# Altium project bms_mainboard-1_1.PrjPcb (part 5 of 8)

## Sheet st-link-v2.SchDoc
size C
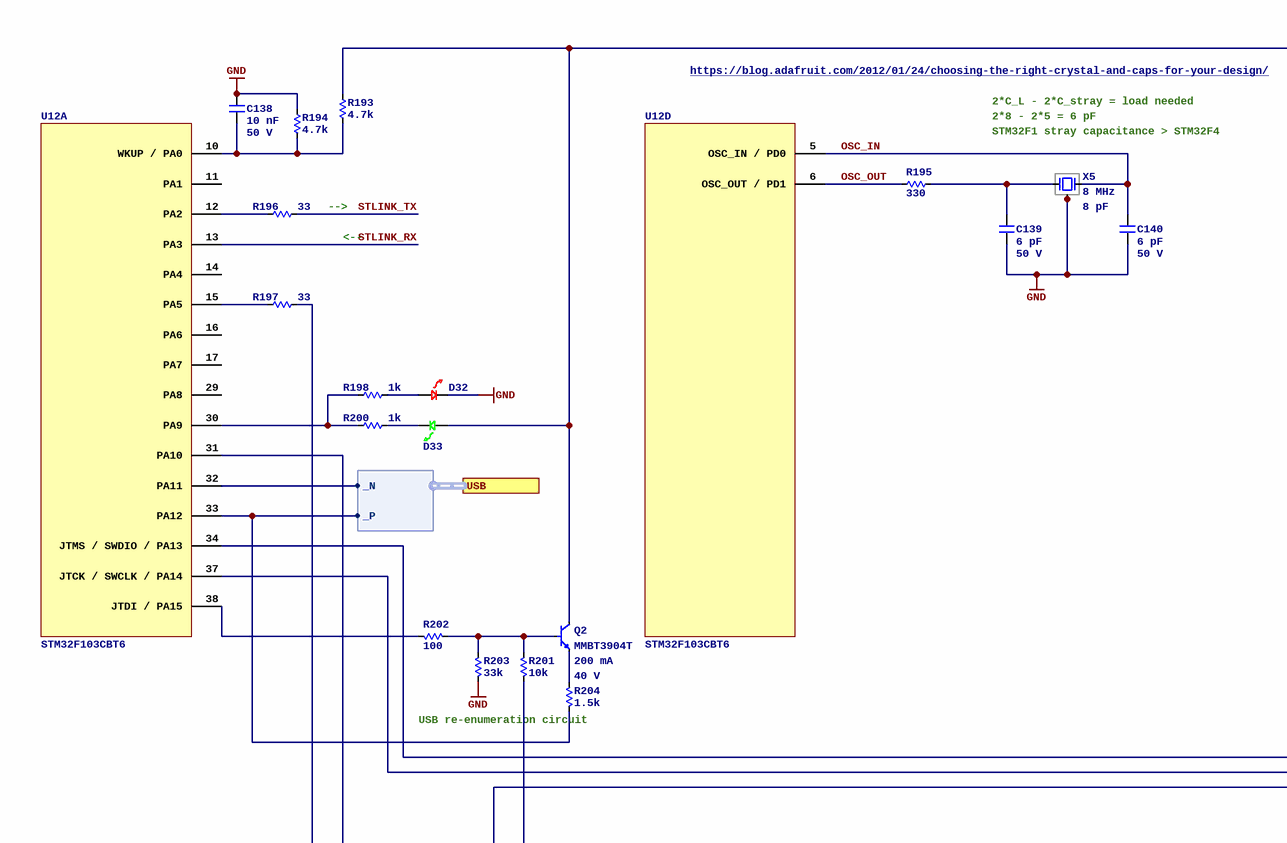
[diagram p25: st-link-v2.SchDoc, top left]
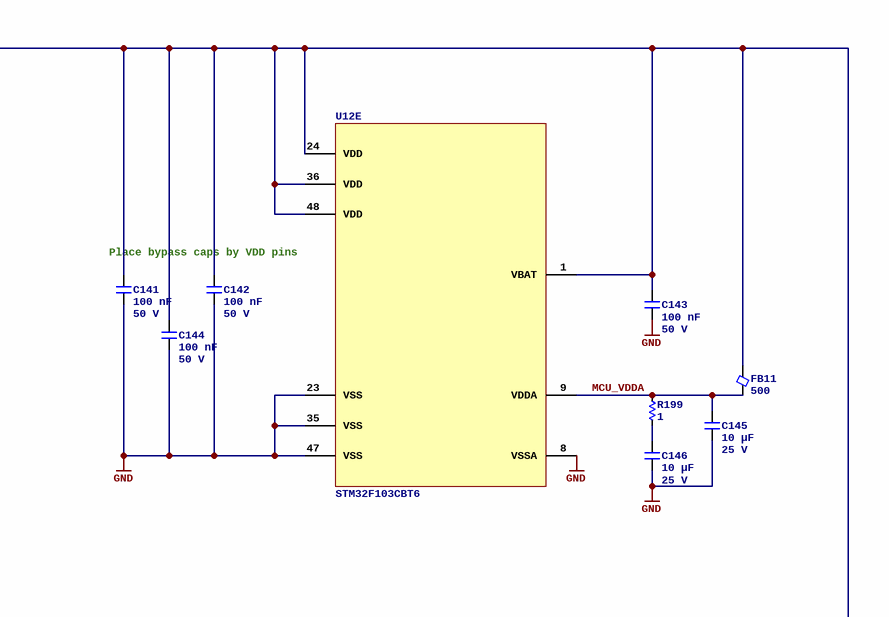
[diagram p26: st-link-v2.SchDoc, top right]
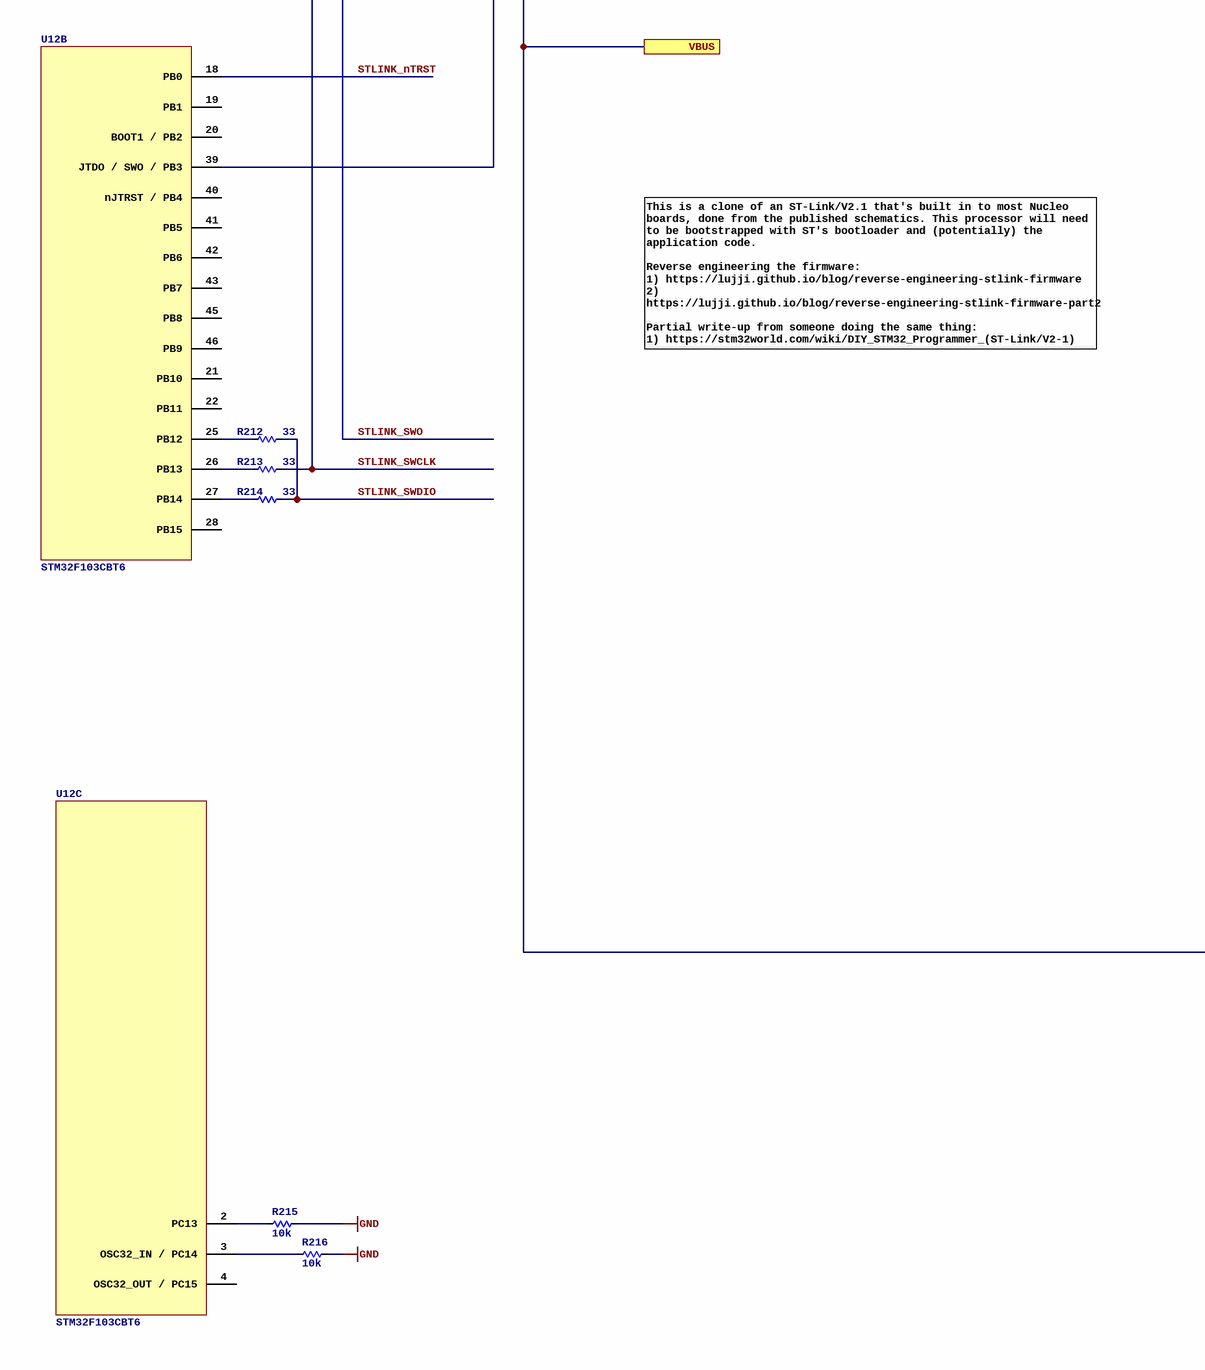
[diagram p27: st-link-v2.SchDoc, bottom left]
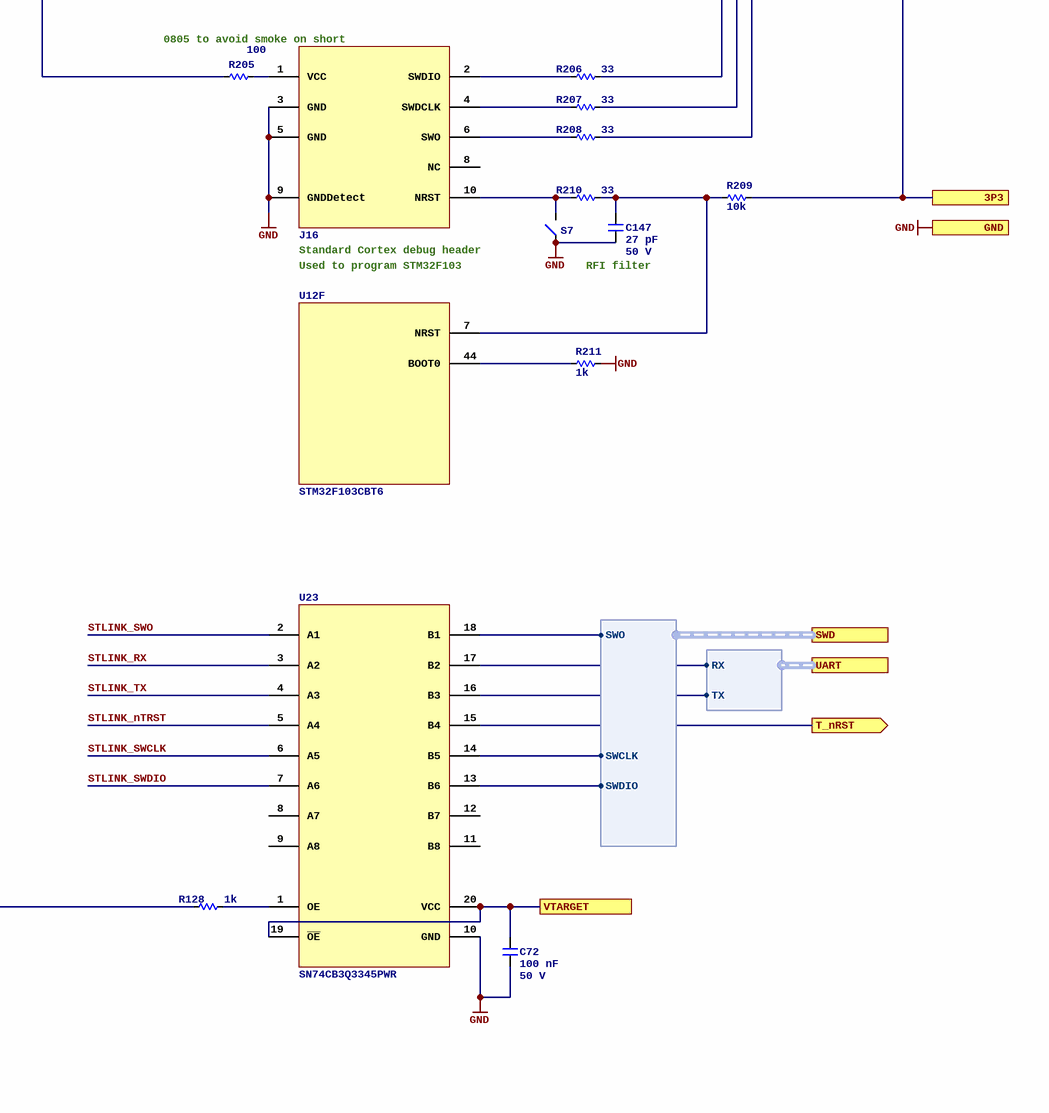
[diagram p28: st-link-v2.SchDoc, bottom right]

### Parts
C72  Capacitance: 100 nF  Voltage Rating: 50 V  [C0402]  (hidden comment: CL05B104KB54PNC)
C138  Capacitance: 10 nF  Voltage Rating: 50 V  [C0402]  (hidden comment: CL05B103KB5NNNC)
C139  Capacitance: 6 pF  Voltage Rating: 50 V  [C0402]  (hidden comment: 0402CG6R0C500NT)
C140  Capacitance: 6 pF  Voltage Rating: 50 V  [C0402]  (hidden comment: 0402CG6R0C500NT)
C141  Capacitance: 100 nF  Voltage Rating: 50 V  [C0402]  (hidden comment: CL05B104KB54PNC)
C142  Capacitance: 100 nF  Voltage Rating: 50 V  [C0402]  (hidden comment: CL05B104KB54PNC)
C143  Capacitance: 100 nF  Voltage Rating: 50 V  [C0402]  (hidden comment: CL05B104KB54PNC)
C144  Capacitance: 100 nF  Voltage Rating: 50 V  [C0402]  (hidden comment: CL05B104KB54PNC)
C145  Capacitance: 10 µF  Voltage Rating: 25 V  [C0603]  (hidden comment: CL10A106MA8NRNC)
C146  Capacitance: 10 µF  Voltage Rating: 25 V  [C0805]  (hidden comment: CL21B106KAYQNNE)
C147  Capacitance: 27 pF  Voltage Rating: 50 V  [C0402]  (hidden comment: 0402CG270J500NT)
D32  LTST-C190KRKT  [LED_0603P_RED]  (value not drawn)
D33  LTST-C190GKT  [LED_0603P_GREEN]  (value not drawn)
FB11  Current Rating (mA): 500  [FB0402]  (hidden comment: BLM15AX601SN1D)
J16  FTSH-105-01-L-DV-K  [FTSH-105-01-L-DV-K_KEYED]  (value not drawn)
Q2  MMBT3904T  Current: 200 mA  Voltage: 40 V  [3SOT523]
R128  value 1k  [R0402]  (hidden comment: 0402WGF1001TCE)
R193  value 4.7k  [R0402]  (hidden comment: 0402WGF4701TCE)
R194  value 4.7k  [R0402]  (hidden comment: 0402WGF4701TCE)
R195  value 330  [R0402]  (hidden comment: 0402WGF3300TCE)
R196  value 33  [R0402]  (hidden comment: 0402WGF330JTCE)
R197  value 33  [R0402]  (hidden comment: 0402WGF330JTCE)
R198  value 1k  [R0402]  (hidden comment: 0402WGF1001TCE)
R199  value 1  [R0402]  (hidden comment: CRCW04021R00FKED)
R200  value 1k  [R0402]  (hidden comment: 0402WGF1001TCE)
R201  value 10k  [R0402]  (hidden comment: 0402WGF1002TCE)
R202  value 100  [R0402]  (hidden comment: RC0402FR-07100RL)
R203  value 33k  [R0402]  (hidden comment: 0402WGF3302TCE)
R204  value 1.5k  [R0402]  (hidden comment: 0402WGF1501TCE)
R205  value 100  [R0805]  (hidden comment: ERJP06F1000V)
R206  value 33  [R0402]  (hidden comment: 0402WGF330JTCE)
R207  value 33  [R0402]  (hidden comment: 0402WGF330JTCE)
R208  value 33  [R0402]  (hidden comment: 0402WGF330JTCE)
R209  value 10k  [R0402]  (hidden comment: 0402WGF1002TCE)
R210  value 33  [R0402]  (hidden comment: 0402WGF330JTCE)
R211  value 1k  [R0402]  (hidden comment: 0402WGF1001TCE)
R212  value 33  [R0402]  (hidden comment: 0402WGF330JTCE)
R213  value 33  [R0402]  (hidden comment: 0402WGF330JTCE)
R214  value 33  [R0402]  (hidden comment: 0402WGF330JTCE)
R215  value 10k  [R0402]  (hidden comment: 0402WGF1002TCE)
R216  value 10k  [R0402]  (hidden comment: 0402WGF1002TCE)
S7  TS-1092S-B3D2-G  [SWITCH_TS-1092S-B3D2-G]  (value not drawn)
U12  STM32F103CBT6  [48TQFP7]  (parts A,B,C,D,E,F of 6)
U23  SN74CB3Q3345PWR  [TI_PW0020A]
X5  Frequency: 8 MHz  Capacitance: 8 pF  [4_SMD_3.2X2.5MM]  (hidden comment: ECS-80-8-33Q-JES-TR)

### Ports
3P3, GND, SWD (harness SWD), T_nRST (out), UART (harness UART), USB (harness DIFF), VBUS, VTARGET

### Harnesses
DIFF: _P, _N
SWD: SWO, SWCLK, SWDIO
UART: RX, TX

### Nets
3P3: C72.1 U23.19(~{OE}) U23.20(VCC) ; port VTARGET
3P3_USB: C141.1 C142.1 C143.1 C144.1 D33.1 FB11.2 Q2.3(C) R193.2 R205.2 R209.1 U12.1(VBAT) U12.24(VDD) U12.36(VDD) U12.48(VDD) ; port 3P3
GND: C72.2 C138.1 C139.2 C140.2 C141.2 C142.2 C143.2 C144.2 C145.2 C146.2 C147.2 D32.2 J16.3(GND) J16.5(GND) J16.9(GNDDetect) R194.2 R203.2 R211.2 R215.2 R216.2 S7.1 U12.8(VSSA) U12.23(VSS) U12.35(VSS) U12.47(VSS) U23.10(GND) X5.2 X5.4 ; port GND
VBUS: R128.2 R201.1 ; port VBUS
MCU_nRST: U23.15(B4) ; port T_nRST
MCU_VDDA: C145.1 FB11.1 R199.2 U12.9(VDDA)
OSC_IN: C140.1 U12.5(OSC_IN_/_PD0) X5.3
OSC_OUT: R195.1 U12.6(OSC_OUT_/_PD1)
STLINK_nTRST: U12.18(PB0) U23.5(A4)
STLINK_RX: U12.13(PA3) U23.3(A2)
STLINK_SWCLK: R197.1 R213.1 U23.6(A5)
STLINK_SWDIO: R212.1 R214.1 U23.7(A6)
STLINK_SWO: U12.31(PA10) U23.2(A1)
STLINK_TX: R196.1 U23.4(A3)
SWD.SWCLK: U23.14(B5) ; port SWD.SWCLK
SWD.SWDIO: U23.13(B6) ; port SWD.SWDIO
SWD.SWO: U23.18(B1) ; port SWD.SWO
UART7.RX: U23.16(B3) ; port UART.TX
UART7.TX: U23.17(B2) ; port UART.RX
USB_DFP2._N: U12.32(PA11) ; port USB._N
USB_DFP2._P: R204.2 U12.33(PA12) ; port USB._P
NetC138_2: C138.2 R193.1 R194.1 U12.10(WKUP_/_PA0)
NetC139_1: C139.1 R195.2 X5.1
NetC146_1: C146.1 R199.1
NetC147_1: C147.1 R209.2 R210.1 U12.7(NRST)
NetD32_1: D32.1 R198.1
NetD33_2: D33.2 R200.1
NetJ16_1: J16.1(VCC) R205.1
NetJ16_2: J16.2(SWDIO) R206.2
NetJ16_4: J16.4(SWDCLK) R207.2
NetJ16_6: J16.6(SWO) R208.2
NetJ16_10: J16.10(NRST) R210.2 S7.2
NetQ2_1: Q2.1(B) R201.2 R202.1 R203.1
NetQ2_2: Q2.2(E) R204.1
NetR128_1: R128.1 U23.1(OE)
NetR196_2: R196.2 U12.12(PA2)
NetR197_2: R197.2 U12.15(PA5)
NetR198_2: R198.2 R200.2 U12.30(PA9)
NetR202_2: R202.2 U12.38(JTDI_/_PA15)
NetR206_1: R206.1 U12.34(JTMS_/_SWDIO_/_PA13)
NetR207_1: R207.1 U12.37(JTCK_/_SWCLK_/_PA14)
NetR208_1: R208.1 U12.39(JTDO_/_SWO_/_PB3)
NetR211_1: R211.1 U12.44(BOOT0)
NetR212_2: R212.2 U12.25(PB12)
NetR213_2: R213.2 U12.26(PB13)
NetR214_2: R214.2 U12.27(PB14)
NetR215_1: R215.1 U12.2(PC13)
NetR216_1: R216.1 U12.3(OSC32_IN_/_PC14)

Not connected (* = marked no-connect by the designer): J16 8(NC); U12 4(OSC32_OUT_/_PC15) 11(PA1) 14(PA4) 16(PA6) 17(PA7) 19(PB1) 20(BOOT1_/_PB2) 21(PB10) 22(PB11) 28(PB15) 29(PA8) 40(nJTRST_/_PB4) 41(PB5) 42(PB6) 43(PB7) 45(PB8) 46(PB9); U23 8(A7) 9(A8) 11(B8) 12(B7)

### Notes on the sheet
- https://blog.adafruit.com/2012/01/24/choosing-the-right-crystal-and-caps-for-your-design/
- 2*C_L - 2*C_stray = load needed
- 2*8 - 2*5 = 6 pF
- (near X5) STM32F1 stray capacitance > STM32F4
- (near R196) -->
- (near R196) <--
- Place bypass caps by VDD pins
- (near R204) USB re-enumeration circuit
- 0805 to avoid smoke on short
- Standard Cortex debug header
- This is a clone of an ST-Link/V2.1 that's built in to most Nucleo boards, done from the published schematics. This processor will need to be bootstrapped with ST's bootloader and (potentially) the application code.
  Reverse engineering the firmware:
  1) https://lujji.github.io/blog/reverse-engineering-stlink-firmware
  2) https://lujji.github.io/blog/reverse-engineering-stlink-firmware-part2
  Partial write-up from someone doing the same thing:
  1) https://stm32world.com/wiki/DIY_STM32_Programmer_(ST-Link/V2-1)
- Used to program STM32F103
- RFI filter

### Library data of the parts
C72 C141-C144 = CL05B104KB54PNC: Manufacturer: Samsung Electro-Mechanics; Dielectric: X7R; ComponentLink1URL: https://wmsc.lcsc.com/wmsc/upload/file/pdf/v2/lcsc/2304140030_Samsung-Electro-Mechanics-CL05B104KB54PNC_C307331.pdf; ComponentLink1Description: Datasheet; Manufacturer Part Number: CL05B104KB54PNC; Package: 0402; Supplier 2: LCSC; Supplier Part Number 2: C307331
C138 = CL05B103KB5NNNC: Manufacturer: Samsung Electro-Mechanics; Dielectric: X7R; ComponentLink1URL: https://wmsc.lcsc.com/wmsc/upload/file/pdf/v2/lcsc/2304140030_Samsung-Electro-Mechanics-CL05B103KB5NNNC_C15195.pdf; ComponentLink1Description: Datasheet; Manufacturer Part Number: CL05B103KB5NNNC; Package: 0402; Supplier 2: LCSC; Supplier Part Number 2: C15195
C139 C140 = 0402CG6R0C500NT: Manufacturer: FH(Guangdong Fenghua Advanced Tech); Dielectric: C0G; ComponentLink1URL: https://wmsc.lcsc.com/wmsc/upload/file/pdf/v2/lcsc/2304140030_FH--Guangdong-Fenghua-Advanced-Tech-0402CG6R0C500NT_C1575.pdf; ComponentLink1Description: Datasheet; Manufacturer Part Number: 0402CG6R0C500NT; Package: 0402; Supplier 2: LCSC; Supplier Part Number 2: C1575
C145 = CL10A106MA8NRNC: Manufacturer: Samsung Electro-Mechanics; Dielectric: X5R; ComponentLink1URL: https://wmsc.lcsc.com/wmsc/upload/file/pdf/v2/lcsc/2304140030_Samsung-Electro-Mechanics-CL10A106MA8NRNC_C96446.pdf; ComponentLink1Description: Datasheet; Manufacturer Part Number: CL10A106MA8NRNC; Package: 0603; Supplier 2: LCSC; Supplier Part Number 2: C96446
C146 = CL21B106KAYQNNE: Manufacturer: Samsung Electro-Mechanics; Dielectric: X7R; ComponentLink1URL: https://datasheet.lcsc.com/lcsc/2206222030_Samsung-Electro-Mechanics-CL21B106KAYQNNE_C3039694.pdf; ComponentLink1Description: Datasheet; Manufacturer Part Number: CL21B106KAYQNNE; Package: 0805; Supplier 2: LCSC; Supplier Part Number 2: C3039694
C147 = 0402CG270J500NT: Manufacturer: FH(Guangdong Fenghua Advanced Tech); Dielectric: C0G; ComponentLink1URL: https://wmsc.lcsc.com/wmsc/upload/file/pdf/v2/lcsc/2304140030_FH--Guangdong-Fenghua-Advanced-Tech-0402CG270J500NT_C1557.pdf; ComponentLink1Description: Datasheet; Manufacturer Part Number: 0402CG270J500NT; Package: 0402; Supplier 2: LCSC; Supplier Part Number 2: C1557
D32 = LTST-C190KRKT: LED SUPER RED CLEAR 0603 SMD; Manufacturer: Lite-On Inc; Vf: 2.0 V; If: 20 mA; ComponentLink1URL: https://optoelectronics.liteon.com/upload/download/DS-22-99-0151/LTST-C190KRKT.pdf; ComponentLink1Description: Datasheet; Supplier 1: DigiKey; Supplier Part Number 1: 160-1436-1-ND; Manufacturer Part Number: LTST-C190KRKT; Supplier 2: LCSC; Supplier Part Number 2: C94869; LED Color: Red; Supplier 3: Mouser; Supplier Part Number 3: 859-LTST-C190KRKT
D33 = LTST-C190GKT: LED GREEN CLEAR 0603 SMD; Manufacturer: Lite-On Inc; Vf: 2.0 V; If: 20 mA; Supplier 1: DigiKey; ComponentLink1URL: https://mm.digikey.com/Volume0/opasdata/d220001/medias/docus/858/LTST-C190GKT.pdf; ComponentLink1Description: Datasheet; Supplier Part Number 1: 160-1183-1-ND; Manufacturer Part Number: LTST-C190GKT; Supplier 2: LCSC; Supplier Part Number 2: C125093; LED Color: Green; Supplier 3: Mouser; Supplier Part Number 3: 859-LTST-C190GKT
FB11 = BLM15AX601SN1D: Manufacturer: Murata Electronics; Z @ 100 MHz: 600; DCR (mOhms): 340; ComponentLink1URL: https://wmsc.lcsc.com/wmsc/upload/file/pdf/v2/lcsc/2304140030_Murata-Electronics-BLM15AX601SN1D_C76886.pdf; ComponentLink1Description: Datasheet; Manufacturer Part Number: BLM15AX601SN1D; Supplier 2: LCSC; Supplier Part Number 2: C76886; Package: 0402
J16 = FTSH-105-01-L-DV-K: CONN HEADER 10 POS DUAL .05" SMD; Manufacturer: Samtec Inc; Supplier 1: DigiKey; ComponentLink1URL: http://www.samtec.com/documents/webfiles/cpdf/FTSH-1XX-XX-XXX-DV-XXX-MKT.pdf; ComponentLink1Description: Datasheet; Supplier Part Number 1: FTSH-105-01-L-DV-K-ND; Manufacturer Part Number: FTSH-105-01-L-DV-K; Supplier 2: LCSC; Supplier Part Number 2: C448647; Supplier 3: Mouser; Supplier Part Number 3: 200-FTSH10501LDVK
Q2 = MMBT3904T: Bipolar (BJT) Transistor NPN 40 V 200 mA 300MHz 150 mW Surface Mount SOT-523; Manufacturer: Shenzhen Slkormicro Semicon Co., Ltd.; Supplier 1: DigiKey; Supplier Part Number 1: 5399-MMBT3904TCT-ND; Manufacturer Part Number: MMBT3904T; ComponentLink1Description: Datasheet; ComponentLink1URL: https://mm.digikey.com/Volume0/opasdata/d220001/medias/docus/7136/5399_MMBT3904T%20SOT-523.pdf; Supplier 2: LCSC; Supplier Part Number 2: C61616; Polarity: NPN
R128 R198 R200 R211 = 0402WGF1001TCE: Manufacturer: UNI-ROYAL(Uniroyal Elec); Tolerance: 1%; Temperature Coefficient: ±100ppm/?; Power Rating (mW): 62.5; ComponentLink1Description: Datasheet; ComponentLink1URL: https://wmsc.lcsc.com/wmsc/upload/file/pdf/v2/lcsc/2206010216_UNI-ROYAL-Uniroyal-Elec-0402WGF1001TCE_C11702.pdf; Manufacturer Part Number: 0402WGF1001TCE; Package: 0402; Supplier 2: LCSC; Supplier Part Number 2: C11702
R193 R194 = 0402WGF4701TCE: Manufacturer: UNI-ROYAL(Uniroyal Elec); Tolerance: 1%; Temperature Coefficient: ±100ppm/?; Power Rating (mW): 62.5; ComponentLink1Description: Datasheet; ComponentLink1URL: https://wmsc.lcsc.com/wmsc/upload/file/pdf/v2/lcsc/2206010045_UNI-ROYAL-Uniroyal-Elec-0402WGF4701TCE_C25900.pdf; Manufacturer Part Number: 0402WGF4701TCE; Package: 0402; Supplier 2: LCSC; Supplier Part Number 2: C25900
R195 = 0402WGF3300TCE: Manufacturer: UNI-ROYAL(Uniroyal Elec); Tolerance: 1%; Temperature Coefficient: ±100ppm/?; Power Rating (mW): 62.5; ComponentLink1Description: Datasheet; ComponentLink1URL: https://wmsc.lcsc.com/wmsc/upload/file/pdf/v2/lcsc/2205311900_UNI-ROYAL-Uniroyal-Elec-0402WGF3300TCE_C25104.pdf; Manufacturer Part Number: 0402WGF3300TCE; Package: 0402; Supplier 2: LCSC; Supplier Part Number 2: C25104
R196 R197 R206-R208 R210 R212-R214 = 0402WGF330JTCE: Manufacturer: UNI-ROYAL(Uniroyal Elec); Tolerance: 1%; Temperature Coefficient: ±100ppm/?; Power Rating (mW): 62.5; ComponentLink1Description: Datasheet; ComponentLink1URL: https://wmsc.lcsc.com/wmsc/upload/file/pdf/v2/lcsc/2205311900_UNI-ROYAL-Uniroyal-Elec-0402WGF330JTCE_C25105.pdf; Manufacturer Part Number: 0402WGF330JTCE; Package: 0402; Supplier 2: LCSC; Supplier Part Number 2: C25105
R199 = CRCW04021R00FKED: Manufacturer: Vishay Intertech; Tolerance: 1%; Temperature Coefficient: ±100ppm/?; Power Rating (mW): 63; ComponentLink1Description: Datasheet; ComponentLink1URL: https://wmsc.lcsc.com/wmsc/upload/file/pdf/v2/lcsc/2211030200_Vishay-Intertech-CRCW04021R00FKED_C482087.pdf; Manufacturer Part Number: CRCW04021R00FKED; Package: 0402; Supplier 2: LCSC; Supplier Part Number 2: C482087
R201 R209 R215 R216 = 0402WGF1002TCE: Manufacturer: UNI-ROYAL(Uniroyal Elec); Tolerance: 1%; Temperature Coefficient: ±100ppm/?; Power Rating (mW): 62.5; ComponentLink1Description: Datasheet; ComponentLink1URL: https://wmsc.lcsc.com/wmsc/upload/file/pdf/v2/lcsc/2206010100_UNI-ROYAL-Uniroyal-Elec-0402WGF1002TCE_C25744.pdf; Manufacturer Part Number: 0402WGF1002TCE; Package: 0402; Supplier 2: LCSC; Supplier Part Number 2: C25744
R202 = RC0402FR-07100RL: Manufacturer: YAGEO; Tolerance: 1%; Temperature Coefficient: ±100ppm/?; Power Rating (mW): 62.5; ComponentLink1Description: Datasheet; ComponentLink1URL: https://wmsc.lcsc.com/wmsc/upload/file/pdf/v2/lcsc/2304140030_YAGEO-RC0402FR-07100RL_C106232.pdf; Manufacturer Part Number: RC0402FR-07100RL; Package: 0402; Supplier 2: LCSC; Supplier Part Number 2: C106232
R203 = 0402WGF3302TCE: Manufacturer: UNI-ROYAL(Uniroyal Elec); Tolerance: 1%; Temperature Coefficient: ±100ppm/?; Power Rating (mW): 62.5; ComponentLink1Description: Datasheet; ComponentLink1URL: https://wmsc.lcsc.com/wmsc/upload/file/pdf/v2/lcsc/2206010100_UNI-ROYAL-Uniroyal-Elec-0402WGF3302TCE_C25779.pdf; Manufacturer Part Number: 0402WGF3302TCE; Package: 0402; Supplier 2: LCSC; Supplier Part Number 2: C25779
R204 = 0402WGF1501TCE: Manufacturer: UNI-ROYAL(Uniroyal Elec); Tolerance: 1%; Temperature Coefficient: ±100ppm/?; Power Rating (mW): 62.5; ComponentLink1Description: Datasheet; ComponentLink1URL: https://wmsc.lcsc.com/wmsc/upload/file/pdf/v2/lcsc/2206010045_UNI-ROYAL-Uniroyal-Elec-0402WGF1501TCE_C25867.pdf; Manufacturer Part Number: 0402WGF1501TCE; Package: 0402; Supplier 2: LCSC; Supplier Part Number 2: C25867
R205 = ERJP06F1000V: Manufacturer: PANASONIC; Tolerance: 1%; Temperature Coefficient: ±100ppm/?; Power Rating (mW): 500; ComponentLink1Description: Datasheet; ComponentLink1URL: https://wmsc.lcsc.com/wmsc/upload/file/pdf/v2/lcsc/2404150944_PANASONIC-ERJP06F1000V_C441975.pdf; Manufacturer Part Number: ERJP06F1000V; Package: 0805; Supplier 2: LCSC; Supplier Part Number 2: C441975
S7 = TS-1092S-B3D2-G: SWITCH TACTILE SPST-NO; Manufacturer: Yuandi; Manufacturer Part Number: TS-1092S-B3D2-G; ComponentLink1Description: Datasheet; ComponentLink1URL: https://www.lcsc.com/datasheet/lcsc_datasheet_2005071437_Yuandi-TS-1092S-B3D2-G_C520860.pdf; Supplier 2: LCSC; Supplier Part Number 2: C520860
U12 = STM32F103CBT6: ARM Cortex-M3 STM32 F1 Microcontroller 32-Bit 72MHz 128kB FLASH LQFP48 STM32F103CBT6; Manufacturer: STMicroelectronics; Supplier 1: DigiKey; Supplier Part Number 1: 497-6288-ND; Manufacturer Part Number: STM32F103CBT6; ComponentLink1Description: Datasheet; ComponentLink1URL: https://www.st.com/resource/en/datasheet/stm32f103cb.pdf; ComponentLink2Description: Reference Manual; ComponentLink2URL: https://www.st.com/resource/en/reference_manual/rm0008-stm32f101xx-stm32f102xx-stm32f103xx-stm32f105xx-and-stm32f107xx-advanced-armbased-32bit-mcus-stmicroelectronics.pdf; Supplier 2: LCSC; Supplier Part Number 2: C8304; Supplier 3: Mouser; Supplier Part Number 3: 511-STM32F103CBT6
U23 = SN74CB3Q3345PWR: Low-voltage high-bandwidth bus switch; Manufacturer: Texas Instruments; Manufacturer Part Number: SN74CB3Q3345PWR; Supplier 1: DigiKey; Supplier Part Number 1: 296-19141-1-ND; Supplier 2: LCSC; Supplier Part Number 2: C2674539; ComponentLink1Description: Datasheet; ComponentLink1URL: https://www.ti.com/lit/ds/symlink/sn74cb3q3345.pdf; Supplier 3: Mouser; Supplier Part Number 3: 595-SN74CB3Q3345PWR
X5 = ECS-80-8-33Q-JES-TR: 8 MHz ±20ppm Crystal 8pF 500 Ohms 4-SMD, No Lead; Manufacturer: ECS Inc.; Supplier 1: DigiKey; Supplier Part Number 1: 50-ECS-80-8-33Q-JES-TRCT-ND; Manufacturer Part Number: ECS-80-8-33Q-JES-TR; Supplier 2: LCSC; Supplier Part Number 2: C5727442; ComponentLink1Description: Datasheet; ComponentLink1URL: https://ecsxtal.com/store/pdf/ECX-33Q.pdf; Supplier 3: Mouser; Supplier Part Number 3: 520-ECS-80-833QJESTR

## Sheet conn_harness_lv.SchDoc
size B
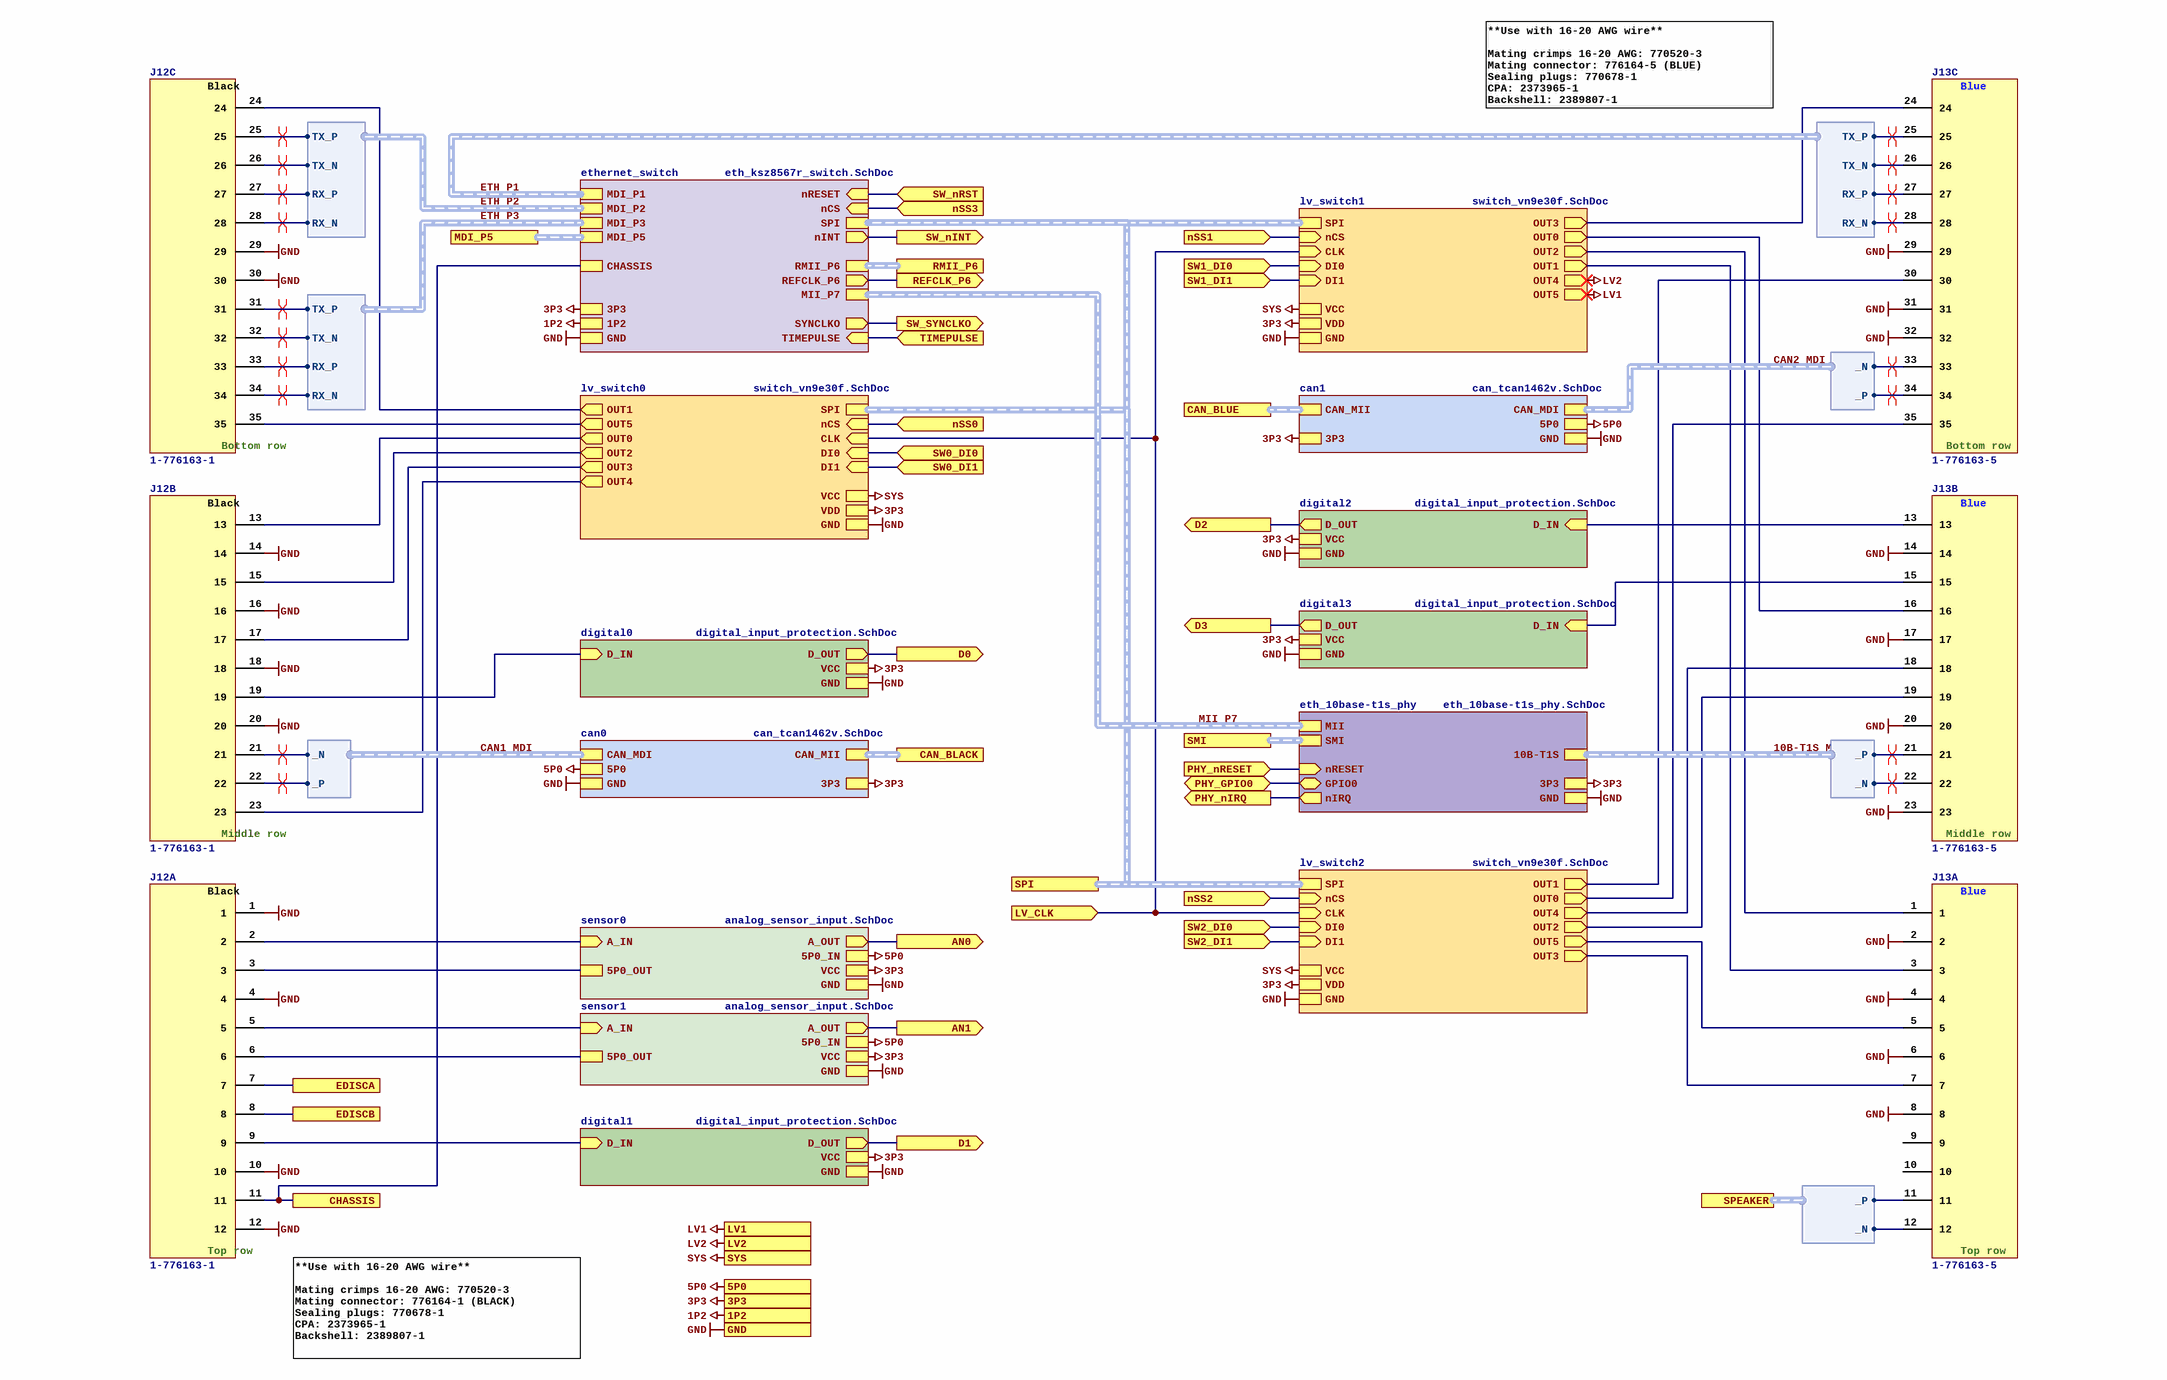
[diagram p29: conn_harness_lv.SchDoc]

### Parts
J12  1-776163-1  [TE_AMPSEAL_1-776163-1]  (parts A,B,C of 3)
J13  1-776163-5  [TE_AMPSEAL_1-776163-5]  (parts A,B,C of 3)

### Sub-sheets
can0 = can_tcan1462v.SchDoc: GND, 5P0, CAN_MII (harness CAN), CAN_MDI (harness DIFF), 3P3
can1 = can_tcan1462v.SchDoc: GND, 5P0, CAN_MII (harness CAN), CAN_MDI (harness DIFF), 3P3
digital0 = digital_input_protection.SchDoc: D_OUT (out), D_IN (in), GND, VCC
digital1 = digital_input_protection.SchDoc: D_OUT (out), D_IN (in), GND, VCC
digital2 = digital_input_protection.SchDoc: D_OUT (out), D_IN (in), GND, VCC
digital3 = digital_input_protection.SchDoc: D_OUT (out), D_IN (in), GND, VCC
eth_10base-t1s_phy = eth_10base-t1s_phy.SchDoc: MII (harness MII), SMI (harness SMI), nRESET (in), GND, 3P3, GPIO0 (bidir), nIRQ (out), 10B-T1S (harness DIFF)
ethernet_switch = eth_ksz8567r_switch.SchDoc: nRESET (in), MDI_P1 (harness 100BASE-TX), MDI_P2 (harness 100BASE-TX), MDI_P3 (harness 100BASE-TX), GND, 1P2, 3P3, RMII_P6 (harness RMII), REFCLK_P6 (out), TIMEPULSE (in), MII_P7 (harness MII), SPI (harness SPI), nCS (in), nINT (out), SYNCLKO (out), CHASSIS, MDI_P5 (harness 100BASE-TX)
lv_switch0 = switch_vn9e30f.SchDoc: OUT0 (out), OUT1 (out), OUT2 (out), OUT3 (out), OUT4 (out), OUT5 (out), VCC, GND, VDD, SPI (harness SPI), nCS (in), CLK (in), DI0 (in), DI1 (in)
lv_switch1 = switch_vn9e30f.SchDoc: OUT0 (out), OUT1 (out), OUT2 (out), OUT3 (out), OUT4 (out), OUT5 (out), VCC, GND, VDD, SPI (harness SPI), nCS (in), CLK (in), DI0 (in), DI1 (in)
lv_switch2 = switch_vn9e30f.SchDoc: OUT0 (out), OUT1 (out), OUT2 (out), OUT3 (out), OUT4 (out), OUT5 (out), VCC, GND, VDD, SPI (harness SPI), nCS (in), CLK (in), DI0 (in), DI1 (in)
sensor0 = analog_sensor_input.SchDoc: A_OUT (out), A_IN (in), 5P0_IN, GND, 5P0_OUT, VCC
sensor1 = analog_sensor_input.SchDoc: A_OUT (out), A_IN (in), 5P0_IN, GND, 5P0_OUT, VCC

### Ports
1P2, 3P3, 5P0, AN0 (out), AN1 (out), CAN_BLACK (harness CAN), CAN_BLUE (harness CAN), CHASSIS, D0 (out), D1 (out), D2 (out), D3 (out), EDISCA, EDISCB, GND, LV1, LV2, LV_CLK (in), MDI_P5 (harness 100BASE-TX), nSS0 (in), nSS1 (in), nSS2 (in), nSS3 (in), PHY_GPIO0 (bidir), PHY_nIRQ (out), PHY_nRESET (in), REFCLK_P6 (out), RMII_P6 (harness RMII), SMI (harness SMI), SPEAKER (harness DIFF), SPI (harness SPI), SW0_DI0 (in), SW0_DI1 (in), SW1_DI0 (in), SW1_DI1 (in), SW2_DI0 (in), SW2_DI1 (in), SW_nINT (out), SW_nRST (in), SW_SYNCLKO (out), SYS, TIMEPULSE (in)

### Harnesses
DIFF: _P, _N
100BASE-TX: TX_N, TX_P, RX_N, RX_P

### Nets
1P2: port 1P2, sheet ethernet_switch/1P2
3P3: port 3P3, sheet can1/3P3, sheet can0/3P3, sheet ethernet_switch/3P3, sheet lv_switch0/VDD, sheet lv_switch1/VDD, sheet lv_switch2/VDD, sheet sensor0/VCC, sheet sensor1/VCC, sheet digital0/VCC, sheet digital1/VCC, sheet digital2/VCC, sheet digital3/VCC, sheet eth_10base-t1s_phy/3P3
5P0: port 5P0, sheet can1/5P0, sheet can0/5P0, sheet sensor0/5P0_IN, sheet sensor1/5P0_IN
CHASSIS: J12.11 ; port CHASSIS, sheet ethernet_switch/CHASSIS
GND: J12.1 J12.4 J12.10 J12.12 J12.14 J12.16 J12.18 J12.20 J12.29 J12.30 J13.2 J13.4 J13.6 J13.8 J13.14 J13.17 J13.20 J13.23 J13.29 J13.31 J13.32 ; port GND, sheet can1/GND, sheet can0/GND, sheet ethernet_switch/GND, sheet lv_switch0/GND, sheet lv_switch1/GND, sheet lv_switch2/GND, sheet sensor0/GND, sheet sensor1/GND, sheet digital0/GND, sheet digital1/GND, sheet digital2/GND, sheet digital3/GND, sheet eth_10base-t1s_phy/GND
LV1: port LV1, sheet lv_switch1/OUT5
LV2: port LV2, sheet lv_switch1/OUT4
SYS: port SYS, sheet lv_switch0/VCC, sheet lv_switch1/VCC, sheet lv_switch2/VCC
10B-T1S_MDI._N: J13.22 ; sheet eth_10base-t1s_phy/10B-T1S._N
10B-T1S_MDI._P: J13.21 ; sheet eth_10base-t1s_phy/10B-T1S._P
AIN0: port AN0, sheet sensor0/A_OUT
AIN1: port AN1, sheet sensor1/A_OUT
CAN1_MDI._N: J12.21 ; sheet can0/CAN_MDI._N
CAN1_MDI._P: J12.22 ; sheet can0/CAN_MDI._P
CAN2_MDI._N: J13.33 ; sheet can1/CAN_MDI._N
CAN2_MDI._P: J13.34 ; sheet can1/CAN_MDI._P
DIN0: port D0, sheet digital0/D_OUT
DIN1: port D1, sheet digital1/D_OUT
DIN2: port D2, sheet digital2/D_OUT
DIN3: port D3, sheet digital3/D_OUT
EDISC_A: J12.7 ; port EDISCA
EDISC_B: J12.8 ; port EDISCB
ETH_P1.RX_N: J13.28 ; sheet ethernet_switch/MDI_P1.RX_N
ETH_P1.RX_P: J13.27 ; sheet ethernet_switch/MDI_P1.RX_P
ETH_P1.TX_N: J13.26 ; sheet ethernet_switch/MDI_P1.TX_N
ETH_P1.TX_P: J13.25 ; sheet ethernet_switch/MDI_P1.TX_P
ETH_P2.RX_N: J12.28 ; sheet ethernet_switch/MDI_P2.RX_N
ETH_P2.RX_P: J12.27 ; sheet ethernet_switch/MDI_P2.RX_P
ETH_P2.TX_N: J12.26 ; sheet ethernet_switch/MDI_P2.TX_N
ETH_P2.TX_P: J12.25 ; sheet ethernet_switch/MDI_P2.TX_P
ETH_P3.RX_N: J12.34 ; sheet ethernet_switch/MDI_P3.RX_N
ETH_P3.RX_P: J12.33 ; sheet ethernet_switch/MDI_P3.RX_P
ETH_P3.TX_N: J12.32 ; sheet ethernet_switch/MDI_P3.TX_N
ETH_P3.TX_P: J12.31 ; sheet ethernet_switch/MDI_P3.TX_P
ETH_REFCLK: port REFCLK_P6, sheet ethernet_switch/REFCLK_P6
ETH_SWITCH_nINT: port SW_nINT, sheet ethernet_switch/nINT
ETH_SWITCH_nRST: port SW_nRST, sheet ethernet_switch/nRESET
ETH_SWITCH_nSS3: port nSS3, sheet ethernet_switch/nCS
ETH_SWITCH_SYNCLKO: port SW_SYNCLKO, sheet ethernet_switch/SYNCLKO
LV_nSS0: port nSS0, sheet lv_switch0/nCS
LV_nSS1: port nSS1, sheet lv_switch1/nCS
LV_nSS2: port nSS2, sheet lv_switch2/nCS
LV_PWM_CLK: port LV_CLK, sheet lv_switch0/CLK, sheet lv_switch1/CLK, sheet lv_switch2/CLK
PHY_GPIO0: port PHY_GPIO0, sheet eth_10base-t1s_phy/GPIO0
PHY_nIRQ: port PHY_nIRQ, sheet eth_10base-t1s_phy/nIRQ
PHY_nRESET: port PHY_nRESET, sheet eth_10base-t1s_phy/nRESET
SPEAKER._N: J13.12 ; port SPEAKER._N
SPEAKER._P: J13.11 ; port SPEAKER._P
SW0_DI0: port SW0_DI0, sheet lv_switch0/DI0
SW0_DI1: port SW0_DI1, sheet lv_switch0/DI1
SW1_DI0: port SW1_DI0, sheet lv_switch1/DI0
SW1_DI1: port SW1_DI1, sheet lv_switch1/DI1
SW2_DI0: port SW2_DI0, sheet lv_switch2/DI0
SW2_DI1: port SW2_DI1, sheet lv_switch2/DI1
TIMEPULSE: port TIMEPULSE, sheet ethernet_switch/TIMEPULSE
NetC148A_1: J12.3 ; sheet sensor0/5P0_OUT
NetC148B_1: J12.6 ; sheet sensor1/5P0_OUT
NetC150A_1: J12.13 ; sheet lv_switch0/OUT0
NetC150B_1: J13.16 ; sheet lv_switch1/OUT0
NetC150C_1: J13.35 ; sheet lv_switch2/OUT0
NetC151A_1: J12.24 ; sheet lv_switch0/OUT1
NetC151B_1: J13.3 ; sheet lv_switch1/OUT1
NetC151C_1: J13.30 ; sheet lv_switch2/OUT1
NetC154A_1: J12.15 ; sheet lv_switch0/OUT2
NetC154B_1: J13.1 ; sheet lv_switch1/OUT2
NetC154C_1: J13.19 ; sheet lv_switch2/OUT2
NetC155A_1: J12.17 ; sheet lv_switch0/OUT3
NetC155B_1: J13.24 ; sheet lv_switch1/OUT3
NetC155C_1: J13.7 ; sheet lv_switch2/OUT3
NetC156A_1: J12.23 ; sheet lv_switch0/OUT4
NetC156C_1: J13.18 ; sheet lv_switch2/OUT4
NetC157A_1: J12.35 ; sheet lv_switch0/OUT5
NetC157C_1: J13.5 ; sheet lv_switch2/OUT5
NetJ12_2: J12.2 ; sheet sensor0/A_IN
NetJ12_5: J12.5 ; sheet sensor1/A_IN
NetJ12_9: J12.9 ; sheet digital1/D_IN
NetJ12_19: J12.19 ; sheet digital0/D_IN
NetJ13_13: J13.13 ; sheet digital2/D_IN
NetJ13_15: J13.15 ; sheet digital3/D_IN

Not connected (* = marked no-connect by the designer): J13 9 10

### Buses and harness runs
harness 10B-T1S_MDI = sheet eth_10base-t1s_phy/10B-T1S
harness CAN1_MDI = sheet can0/CAN_MDI
harness CAN2_MDI = sheet can1/CAN_MDI
harness ETH_P1 = sheet ethernet_switch/MDI_P1
harness ETH_P2 = sheet ethernet_switch/MDI_P2
harness ETH_P3 = sheet ethernet_switch/MDI_P3
harness MII_P7 = sheet eth_10base-t1s_phy/MII = sheet ethernet_switch/MII_P7
harness port CAN_BLACK = sheet can0/CAN_MII
harness port CAN_BLUE = sheet can1/CAN_MII
harness port MDI_P5 = sheet ethernet_switch/MDI_P5
harness port RMII_P6 = sheet ethernet_switch/RMII_P6
harness port SMI = sheet eth_10base-t1s_phy/SMI
harness port SPI = sheet ethernet_switch/SPI = sheet lv_switch0/SPI = sheet lv_switch1/SPI = sheet lv_switch2/SPI

### Layout directives
differential pair; differential pair class DE_120: CAN1_MDI._N, CAN1_MDI._P, CAN2_MDI._N, CAN2_MDI._P
differential pair; differential pair class DE_100: 10B-T1S_MDI._N, 10B-T1S_MDI._P, ETH_P1.RX_N, ETH_P1.RX_P, ETH_P1.TX_N, ETH_P1.TX_P, ETH_P2.RX_N, ETH_P2.RX_P, ETH_P2.TX_N, ETH_P2.TX_P, ETH_P3.RX_N, ETH_P3.RX_P, ETH_P3.TX_N, ETH_P3.TX_P

### Notes on the sheet
- **Use with 16-20 AWG wire**
  Mating crimps 16-20 AWG: 770520-3
  Mating connector: 776164-5 (BLUE)
  Sealing plugs: 770678-1
  CPA: 2373965-1
  Backshell: 2389807-1
- **Use with 16-20 AWG wire**
  Mating crimps 16-20 AWG: 770520-3
  Mating connector: 776164-1 (BLACK)
  Sealing plugs: 770678-1
  CPA: 2373965-1
  Backshell: 2389807-1
- (in symbol 1-776163-1, part A) Black; Top row
- (in symbol 1-776163-1, part B) Black; Middle row
- (in symbol 1-776163-1, part C) Black; Bottom row
- (in symbol 1-776163-5, part A) Blue; Top row
- (in symbol 1-776163-5, part B) Blue; Middle row
- (in symbol 1-776163-5, part C) Blue; Bottom row

### Library data of the parts
J12 = 1-776163-1: Conn Power PL 35 POS 4mm Solder RA Thru-Hole 35 Terminal 1 Port, BLACK; Manufacturer: TE Connectivity; Supplier 1: DigiKey; Supplier Part Number 1: A106383-ND; Manufacturer Part Number: 1-776163-1; ComponentLink1Description: Product page; ComponentLink1URL: https://www.te.com/en/product-1-776163-1.html; ComponentLink2Description: Drawing; ComponentLink2URL: https://www.te.com/commerce/DocumentDelivery/DDEController?Action=showdoc&DocId=Customer+Drawing%7F776163%7FK%7Fpdf%7FEnglish%7FENG_CD_776163_K.pdf%7F1-776163-1; ComponentLink3Description: Application specification; ComponentLink3URL: https://www.te.com/commerce/DocumentDelivery/DDEController?Action=showdoc&DocId=Specification+Or+Standard%7F114-16016%7FR1%7Fpdf%7FEnglish%7FENG_SS_114-16016_R1.pdf%7F1-776163-1; Supplier 2: LCSC; Supplier Part Number 2: C596198; ComponentLink4Description: Series catalog; ComponentLink4URL: https://www.te.com/commerce/DocumentDelivery/DDEController?Action=showdoc&DocId=Data+Sheet%7F1-1773979-2%7FA%7Fpdf%7FEnglish%7FENG_DS_1-1773979-2_A.pdf%7F1-776280-1; ComponentLink5Description: Product specification; ComponentLink5URL: https://www.te.com/commerce/DocumentDelivery/DDEController?Action=showdoc&DocId=Specification+Or+Standard%7F108-1329%7FE1%7Fpdf%7FEnglish%7FENG_SS_108-1329_E1.pdf%7F1-776163-1; Supplier 3: Mouser; Supplier Part Number 3: 571-1-776163-1
J13 = 1-776163-5: Conn Power PL 35 POS 4mm Solder RA Thru-Hole 35 Terminal 1 Port, BLUE; Manufacturer: TE Connectivity; Supplier 1: DigiKey; Supplier Part Number 1: 1-776163-5-ND; Manufacturer Part Number: 1-776163-5; ComponentLink1Description: Product page; ComponentLink1URL: https://www.te.com/en/product-1-776163-5.html; ComponentLink2Description: Drawing; ComponentLink2URL: https://www.te.com/commerce/DocumentDelivery/DDEController?Action=showdoc&DocId=Customer+Drawing%7F776163%7FK%7Fpdf%7FEnglish%7FENG_CD_776163_K.pdf%7F1-776163-5; ComponentLink3Description: Application specification; ComponentLink3URL: https://www.te.com/commerce/DocumentDelivery/DDEController?Action=showdoc&DocId=Specification+Or+Standard%7F114-16016%7FR1%7Fpdf%7FEnglish%7FENG_SS_114-16016_R1.pdf%7F1-776163-5; Supplier 2: LCSC; Supplier Part Number 2: C17378321; ComponentLink4Description: Series catalog; ComponentLink4URL: https://www.te.com/commerce/DocumentDelivery/DDEController?Action=showdoc&DocId=Data+Sheet%7F1-1773979-2%7FA%7Fpdf%7FEnglish%7FENG_DS_1-1773979-2_A.pdf%7F1-776163-5; ComponentLink5Description: Product specification; ComponentLink5URL: https://www.te.com/commerce/DocumentDelivery/DDEController?Action=showdoc&DocId=Specification+Or+Standard%7F108-1329%7FE1%7Fpdf%7FEnglish%7FENG_SS_108-1329_E1.pdf%7F1-776163-5; Supplier 3: Mouser; Supplier Part Number 3: 571-1-776163-5

## Sheet can_tcan1462v.SchDoc
size A
Used 2 times, as channels conn_harness_lv/can1, conn_harness_lv/can0. Parts and nets are listed once, with the designators drawn on the sheet.
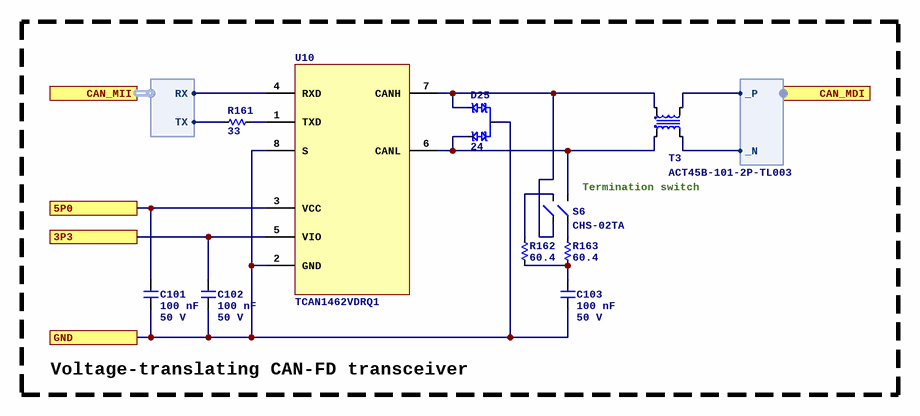
[diagram p30: can_tcan1462v.SchDoc]

### Parts
C101  Capacitance: 100 nF  Voltage Rating: 50 V  [C0402]  (hidden comment: CL05B104KB54PNC)
C102  Capacitance: 100 nF  Voltage Rating: 50 V  [C0402]  (hidden comment: CL05B104KB54PNC)
C103  Capacitance: 100 nF  Voltage Rating: 50 V  [C0402]  (hidden comment: CL05B104KB54PNC)
D25  Standoff (V): 24  [3SOT23]  (hidden comment: PESD2CAN,215)
R161  value 33  [R0402]  (hidden comment: 0402WGF330JTCE)
R162  value 60.4  [R0402]  (hidden comment: FRC0402F60R4TS)
R163  value 60.4  [R0402]  (hidden comment: FRC0402F60R4TS)
S6  CHS-02TA  [SWITCH_NIDEC_CHS-02TA]
T3  ACT45B-101-2P-TL003  [CHOKE_ACT45B-101-2P-TL003]
U10  TCAN1462VDRQ1  [8SOIC150]

### Ports
3P3, 5P0, CAN_MDI (harness DIFF), CAN_MII (harness CAN), GND

### Harnesses
CAN: TX, RX
DIFF: _P, _N

### Nets
3P3: C102.1 U10.5(VIO) ; port 3P3
5P0: C101.1 U10.3(VCC) ; port 5P0
GND: C101.2 C102.2 C103.2 D25.3 U10.2(GND) U10.8(S) ; port GND
NetC103_1: C103.1 R162.2 R163.1
NetD25_1: D25.1 S6.1 T3.1 U10.7(CANH)
NetD25_2: D25.2 S6.4 T3.2 U10.6(CANL)
NetR161_1: R161.1 ; port CAN_MII.TX
NetR161_2: R161.2 U10.1(TXD)
NetR162_1: R162.1 S6.2
NetR163_2: R163.2 S6.3
NetT3_3: T3.3 ; port CAN_MDI._N
NetT3_4: T3.4 ; port CAN_MDI._P
NetU10_4: U10.4(RXD) ; port CAN_MII.RX

### Channels
conn_harness_lv/can1: designators end in A; ports 3P3=3P3 5P0=5P0 GND=GND
conn_harness_lv/can0: designators end in B; ports 3P3=3P3 5P0=5P0 GND=GND

### Notes on the sheet
- (near S6) Termination switch
- Voltage-translating CAN-FD transceiver

### Library data of the parts
C101-C103 = CL05B104KB54PNC: as C72 on sheet st-link-v2; ComponentLink1URL: https://wmsc.lcsc.com/wmsc/upload/file/pdf/v2/lcsc/2304140030_Samsung-Electro-Mechanics-CL05B104KB54PNC_C307331.pdf; ComponentLink1Description: Datasheet; Manufacturer Part Number: CL05B104KB54PNC; Package: 0402; Supplier 2: LCSC; Supplier Part Number 2: C307331
D25 = PESD2CAN,215: DIODE ESD CAN SOT-23; Manufacturer: NXP Semiconductors; Polarity: Bidirectional; Capacitance (pF): 30; Min Breakdown Voltage: 26.2 V; Clamping Voltage-Max: 41 V; Power (W): 230; Supplier 1: DigiKey; ComponentLink1URL: https://assets.nexperia.com/documents/data-sheet/PESD2CAN.pdf; ComponentLink1Description: Datasheet; Supplier Part Number 1: 1727-3891-1-ND; Manufacturer Part Number: PESD2CAN,215; Supplier 2: LCSC; Supplier Part Number 2: C75176; Supplier 3: Mouser; Supplier Part Number 3: 771-PESD2CAN-T/R
R161 = 0402WGF330JTCE: as R196 on sheet st-link-v2; ComponentLink1Description: Datasheet; ComponentLink1URL: https://wmsc.lcsc.com/wmsc/upload/file/pdf/v2/lcsc/2205311900_UNI-ROYAL-Uniroyal-Elec-0402WGF330JTCE_C25105.pdf; Manufacturer Part Number: 0402WGF330JTCE; Package: 0402; Supplier 2: LCSC; Supplier Part Number 2: C25105
R162 R163 = FRC0402F60R4TS: Manufacturer: FOJAN; Tolerance: 1%; Temperature Coefficient: ±100ppm/?; Power Rating (mW): 62.5; ComponentLink1Description: Datasheet; ComponentLink1URL: https://datasheet.lcsc.com/lcsc/2308241947_FOJAN-FRC0402F60R4TS_C2960873.pdf; Manufacturer Part Number: FRC0402F60R4TS; Package: 0402; Supplier 2: LCSC; Supplier Part Number 2: C2960873
S6 = CHS-02TA: DIP Switch, Slide, SPST, Flush, Recessed, 6VDC, 100mA, CHS Series Ž Nidec Components CHS-02TA; Manufacturer: Nidec Copal; Supplier 1: DigiKey; Supplier Part Number 1: 563-1005-1-ND; Manufacturer Part Number: CHS-02TA; Supplier 2: LCSC; Supplier Part Number 2: C2921606; ComponentLink1Description: Datasheet; ComponentLink1URL: https://www.nidec-components.com/e/catalog/switch/chs.pdf; Supplier 3: Mouser; Supplier Part Number 3: 229-CHS-02TA
T3 = ACT45B-101-2P-TL003: CHOKE COMMON MODE 5000 OHM SMD; Manufacturer: TDK Corporation; Supplier 1: DigiKey; Manufacturer Part Number: ACT45B-101-2P-TL003; ComponentLink1URL: http://www.tdk.co.jp/tefe02/e9711_act.pdf; ComponentLink1Description: Datasheet; Supplier Part Number 1: 445-3959-1-ND; Supplier 2: LCSC; Supplier Part Number 2: C88056; Supplier 3: Mouser; Supplier Part Number 3: 810-ACT45B1012PTL003
U10 = TCAN1462VDRQ1: Automotive signal improvement CAN FD transceiver with VIO and standby 8-SOIC -40 to 125; Manufacturer: Texas Instruments; Supplier 1: DigiKey; Supplier Part Number 1: 296-TCAN1462VDRQ1CT-ND; Manufacturer Part Number: TCAN1462VDRQ1; ComponentLink1Description: Datasheet; ComponentLink1URL: https://www.ti.com/lit/ds/symlink/tcan1462-q1.pdf; Supplier 2: LCSC; Supplier Part Number 2: C7399456; Supplier 3: Mouser; Supplier Part Number 3: 595-TCAN1462VDRQ1